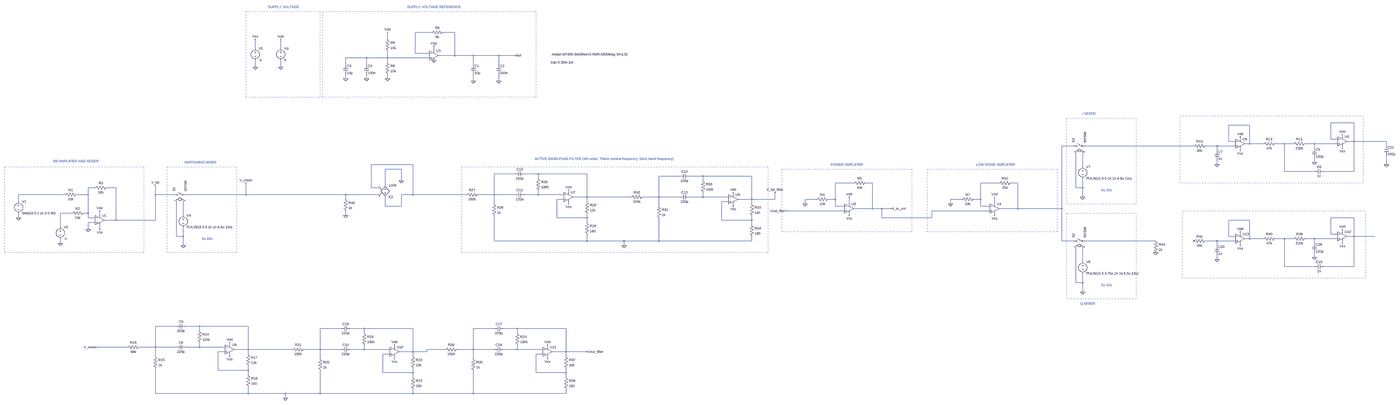
[diagram p0: schematic transceiver.asc, whole sheet]
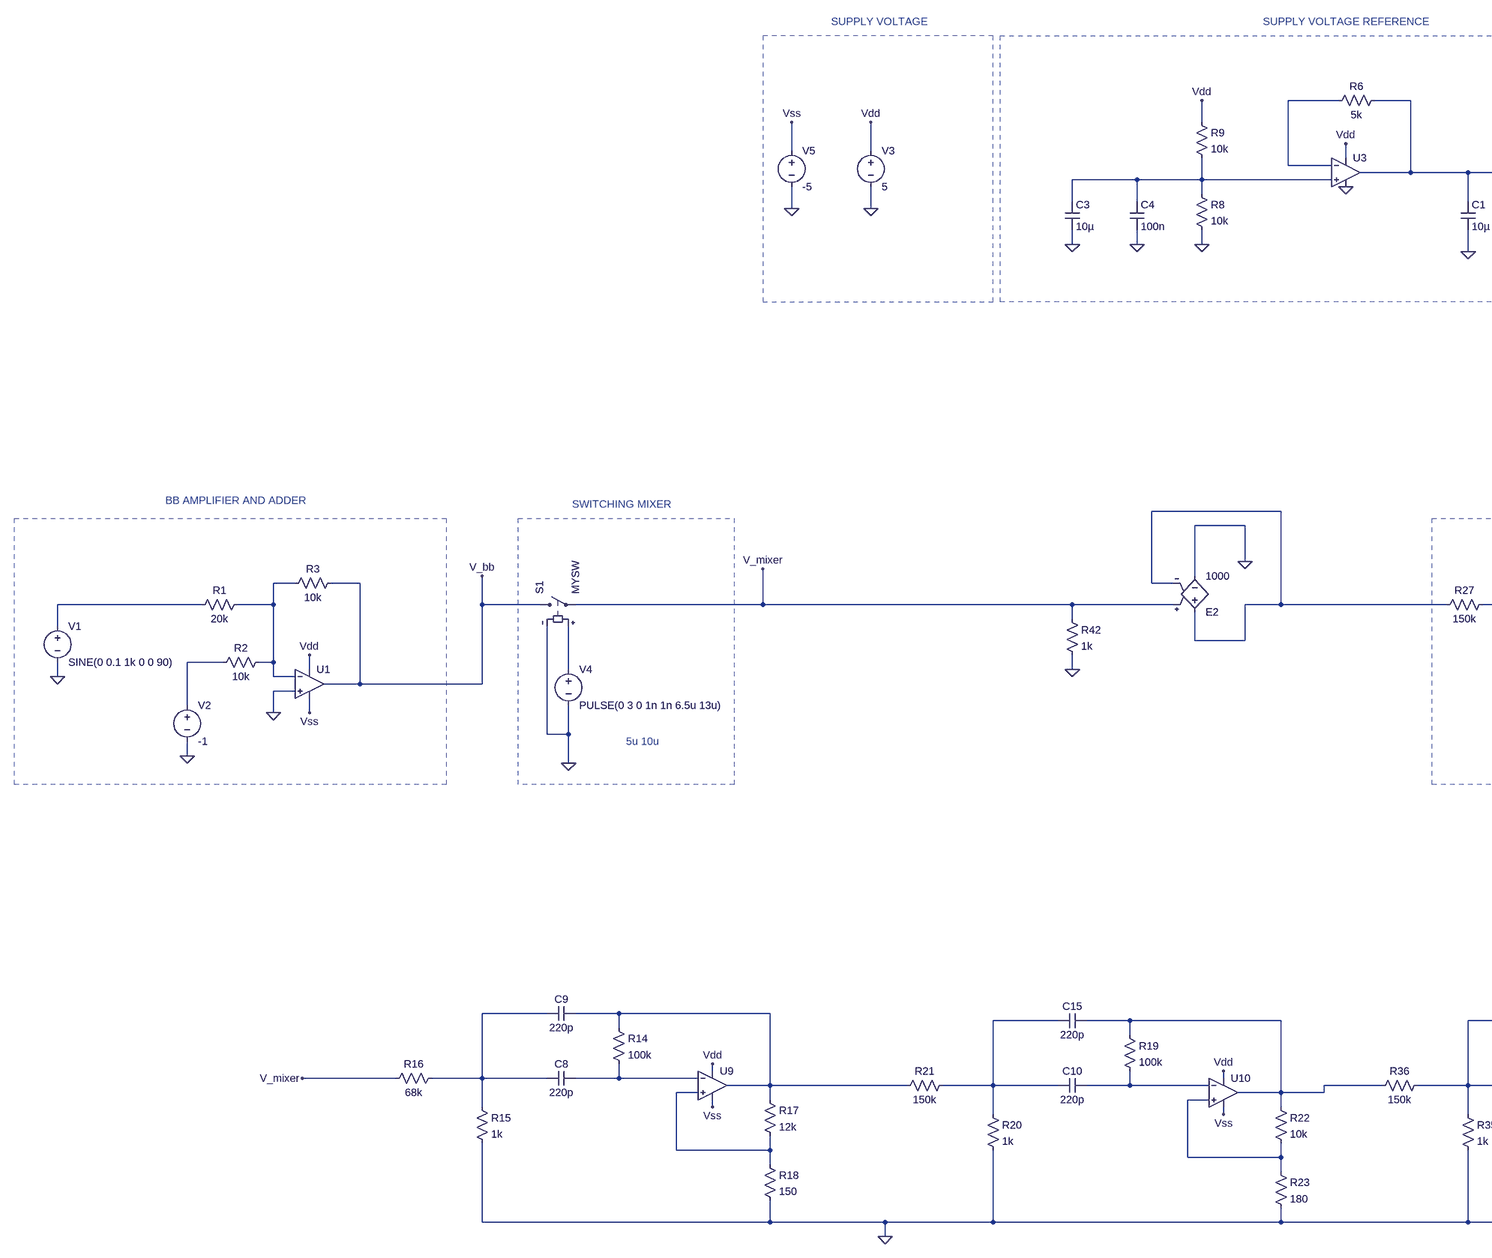
[diagram p1: schematic transceiver.asc, part, row 1 of 1, column 1 of 3]
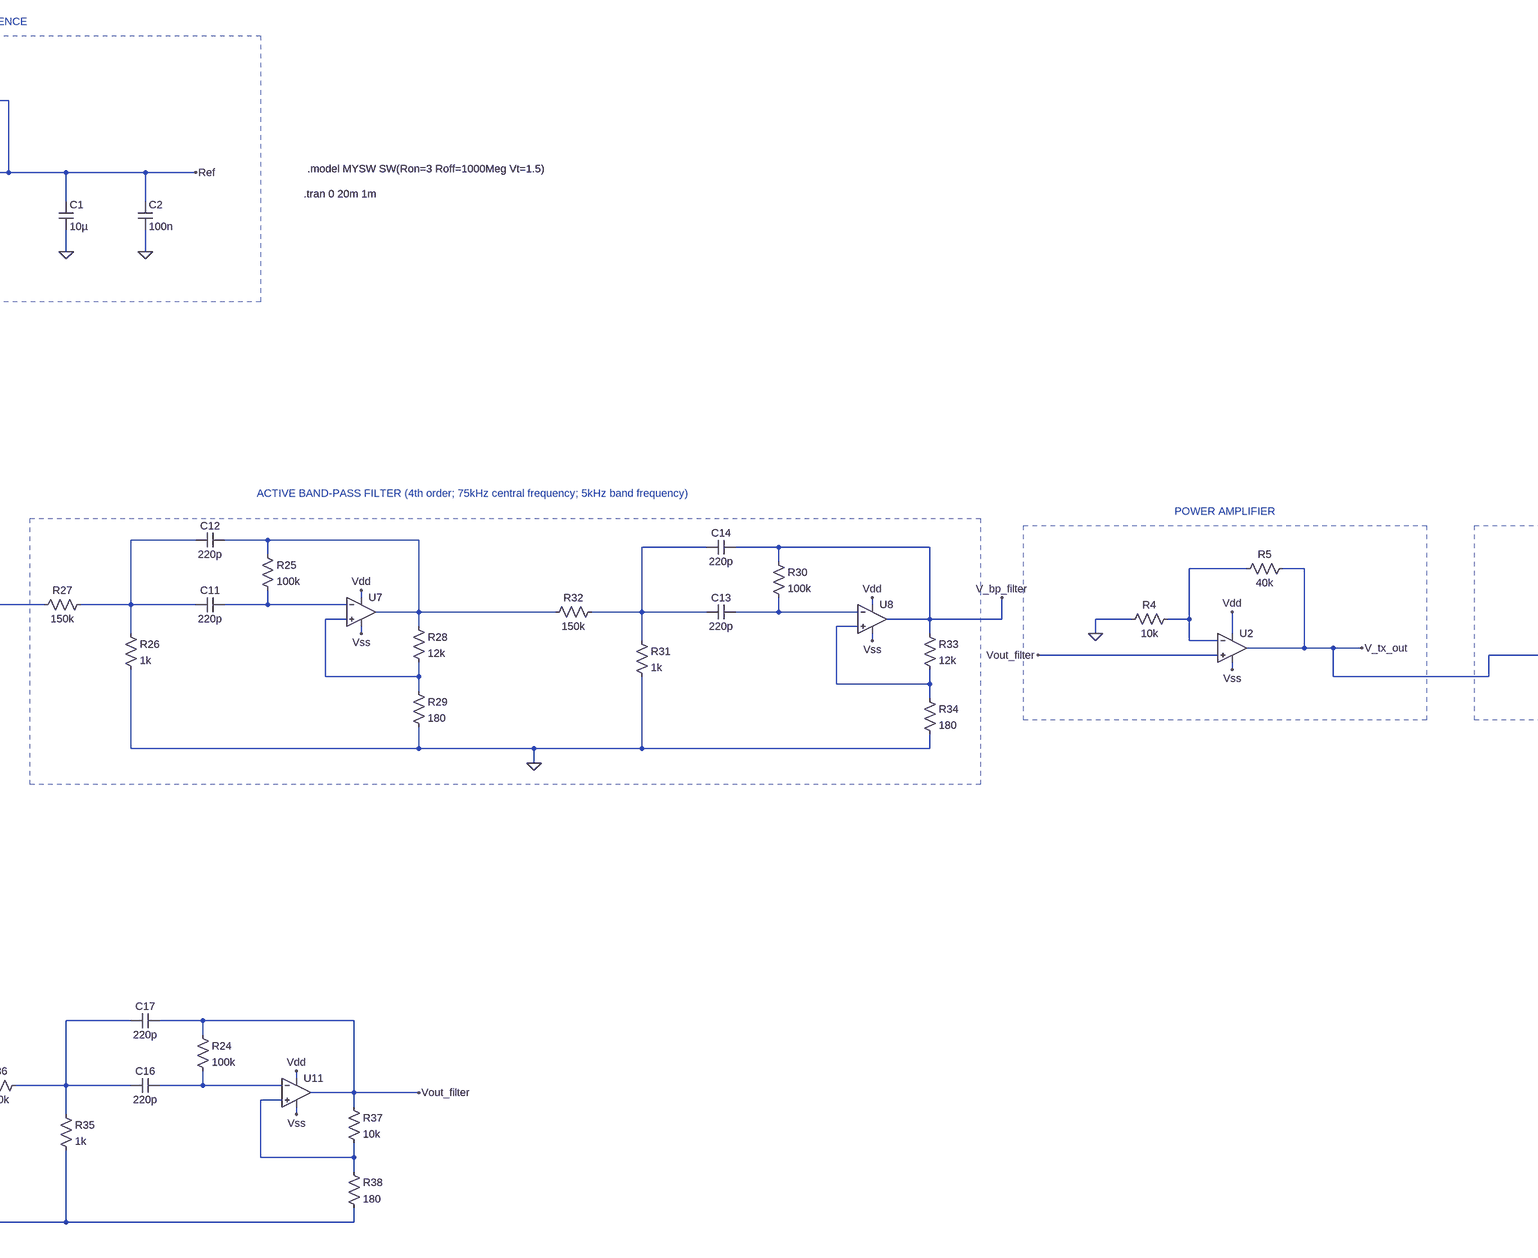
[diagram p2: schematic transceiver.asc, part, row 1 of 1, column 2 of 3]
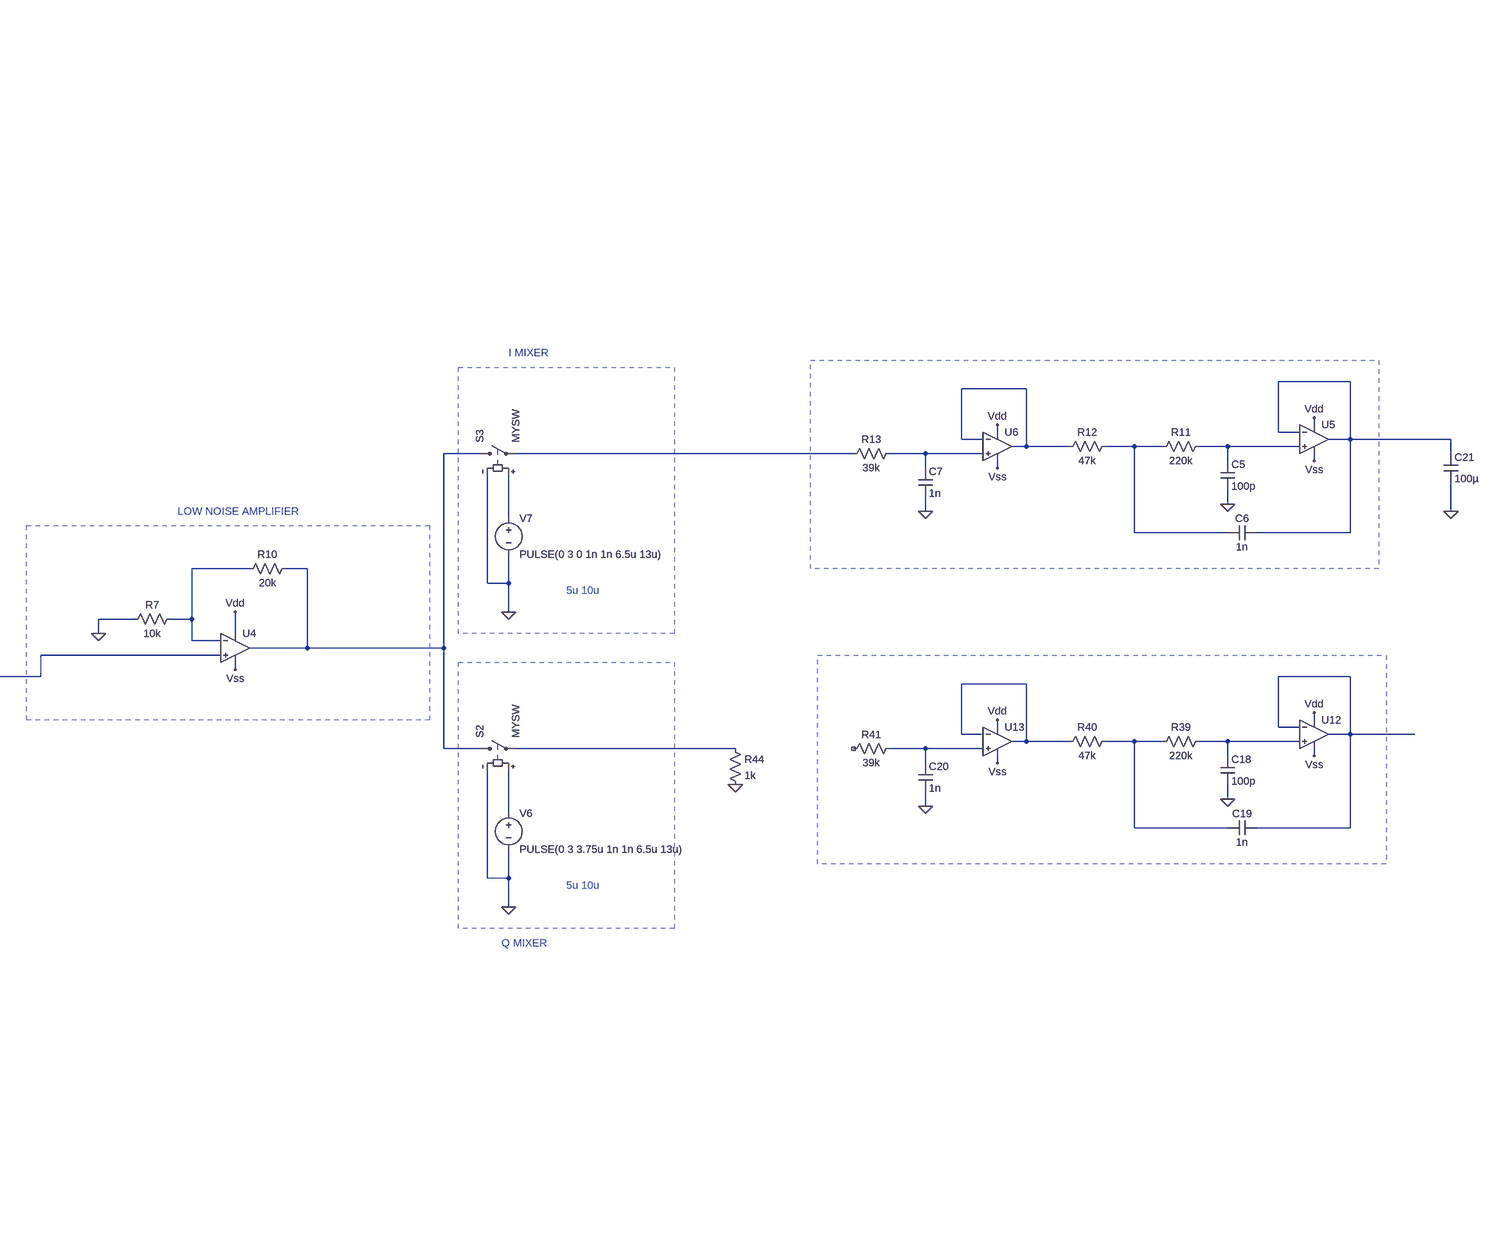
[diagram p3: schematic transceiver.asc, part, row 1 of 1, column 3 of 3]
transceiver.asc, the LTspice schematic file:
Version 4
SHEET 1 5896 1220
WIRE -944 -1920 -1056 -1920
WIRE -784 -1920 -864 -1920
WIRE -1248 -1872 -1248 -1920
WIRE -2160 -1808 -2160 -1872
WIRE -1984 -1808 -1984 -1872
WIRE -928 -1792 -928 -1824
WIRE -1056 -1776 -1056 -1920
WIRE -960 -1776 -1056 -1776
WIRE -784 -1760 -784 -1920
WIRE -784 -1760 -896 -1760
WIRE -656 -1760 -784 -1760
WIRE -480 -1760 -656 -1760
WIRE -368 -1760 -480 -1760
WIRE -1392 -1744 -1536 -1744
WIRE -1248 -1744 -1248 -1792
WIRE -1248 -1744 -1392 -1744
WIRE -960 -1744 -1248 -1744
WIRE -1248 -1712 -1248 -1744
WIRE -1536 -1696 -1536 -1744
WIRE -1392 -1696 -1392 -1744
WIRE -656 -1696 -656 -1760
WIRE -480 -1696 -480 -1760
WIRE -2160 -1680 -2160 -1728
WIRE -1984 -1680 -1984 -1728
WIRE -1536 -1600 -1536 -1632
WIRE -1392 -1600 -1392 -1632
WIRE -1248 -1600 -1248 -1632
WIRE -656 -1584 -656 -1632
WIRE -480 -1584 -480 -1632
WIRE 5600 -768 5440 -768
WIRE 4880 -752 4736 -752
WIRE 5520 -672 5520 -688
WIRE 4816 -656 4816 -672
WIRE 5440 -656 5440 -768
WIRE 5488 -656 5440 -656
WIRE 4736 -640 4736 -752
WIRE 4784 -640 4736 -640
WIRE 5600 -640 5600 -768
WIRE 5600 -640 5552 -640
WIRE 5824 -640 5600 -640
WIRE 4880 -624 4880 -752
WIRE 4880 -624 4848 -624
WIRE 4976 -624 4880 -624
WIRE 5120 -624 5056 -624
WIRE 5184 -624 5120 -624
WIRE 5328 -624 5264 -624
WIRE 5488 -624 5328 -624
WIRE 3584 -608 3504 -608
WIRE 4496 -608 3664 -608
WIRE 4656 -608 4576 -608
WIRE 4784 -608 4656 -608
WIRE 5824 -608 5824 -640
WIRE 5328 -592 5328 -624
WIRE 5520 -592 5520 -608
WIRE 4656 -576 4656 -608
WIRE 4816 -576 4816 -592
WIRE 5328 -496 5328 -528
WIRE -1072 -480 -1360 -480
WIRE 4656 -480 4656 -512
WIRE 5824 -480 5824 -544
WIRE 3648 -464 3648 -560
WIRE -1152 -448 -1264 -448
WIRE 5120 -432 5120 -624
WIRE 5328 -432 5120 -432
WIRE 5600 -432 5600 -640
WIRE 5600 -432 5392 -432
WIRE -368 -416 -512 -416
WIRE -208 -416 -304 -416
WIRE 128 -416 -208 -416
WIRE 768 -400 624 -400
WIRE 928 -400 832 -400
WIRE 1264 -400 928 -400
WIRE -208 -384 -208 -416
WIRE -1152 -368 -1152 -448
WIRE 928 -368 928 -400
WIRE 1968 -352 1840 -352
WIRE 2096 -352 2048 -352
WIRE 3072 -352 2944 -352
WIRE 3200 -352 3152 -352
WIRE -1264 -336 -1264 -448
WIRE -3264 -320 -3312 -320
WIRE -3120 -320 -3184 -320
WIRE -1360 -320 -1360 -480
WIRE -1312 -320 -1360 -320
WIRE 3600 -320 3600 -560
WIRE 3648 -320 3648 -384
WIRE 3648 -320 3600 -320
WIRE 0 -288 0 -304
WIRE -3472 -272 -3792 -272
WIRE -3312 -272 -3312 -320
WIRE -3312 -272 -3392 -272
WIRE -2848 -272 -2848 -336
WIRE -2720 -272 -2848 -272
WIRE -2224 -272 -2224 -352
WIRE -2224 -272 -2640 -272
WIRE -1536 -272 -2224 -272
WIRE -1312 -272 -1536 -272
WIRE -1072 -272 -1072 -480
WIRE -1072 -272 -1152 -272
WIRE -704 -272 -1072 -272
WIRE -512 -272 -512 -416
WIRE -512 -272 -624 -272
WIRE -368 -272 -512 -272
WIRE -208 -272 -208 -304
WIRE -208 -272 -304 -272
WIRE -32 -272 -208 -272
WIRE 1136 -272 1136 -288
WIRE 128 -256 128 -416
WIRE 128 -256 32 -256
WIRE 432 -256 128 -256
WIRE 624 -256 624 -400
WIRE 624 -256 512 -256
WIRE 768 -256 624 -256
WIRE 928 -256 928 -288
WIRE 928 -256 832 -256
WIRE 1104 -256 928 -256
WIRE 3648 -256 3648 -320
WIRE -1536 -240 -1536 -272
WIRE -32 -240 -80 -240
WIRE 1264 -240 1264 -400
WIRE 1264 -240 1168 -240
WIRE 1424 -240 1424 -288
WIRE 1424 -240 1264 -240
WIRE 1712 -240 1632 -240
WIRE 1840 -240 1840 -352
WIRE 1840 -240 1792 -240
WIRE 2816 -240 2736 -240
WIRE 2944 -240 2944 -352
WIRE 2944 -240 2896 -240
WIRE -3792 -224 -3792 -272
WIRE 128 -224 128 -256
WIRE 1104 -224 1056 -224
WIRE -512 -208 -512 -272
WIRE 0 -208 0 -224
WIRE 1264 -208 1264 -240
WIRE 1632 -208 1632 -240
WIRE 1936 -208 1936 -256
WIRE 2736 -208 2736 -240
WIRE 3040 -208 3040 -256
WIRE -1264 -192 -1264 -256
WIRE -1152 -192 -1152 -272
WIRE -1152 -192 -1264 -192
WIRE 624 -192 624 -256
WIRE 1136 -192 1136 -208
WIRE 1840 -192 1840 -240
WIRE 1904 -192 1840 -192
WIRE 2944 -192 2944 -240
WIRE 3008 -192 2944 -192
WIRE 2096 -176 2096 -352
WIRE 2096 -176 1968 -176
WIRE 2160 -176 2096 -176
WIRE 2224 -176 2160 -176
WIRE 3200 -176 3200 -352
WIRE 3200 -176 3072 -176
WIRE 3504 -176 3504 -608
WIRE 3504 -176 3200 -176
WIRE 1904 -160 1504 -160
WIRE 3008 -160 2608 -160
WIRE -3424 -144 -3504 -144
WIRE -3312 -144 -3312 -272
WIRE -3312 -144 -3344 -144
WIRE -3232 -128 -3232 -160
WIRE -2656 -128 -2656 -224
WIRE -1536 -128 -1536 -160
WIRE 1936 -128 1936 -144
WIRE 3040 -128 3040 -144
WIRE -3792 -112 -3792 -144
WIRE -3312 -112 -3312 -144
WIRE -3264 -112 -3312 -112
WIRE -80 -112 -80 -240
WIRE 128 -112 128 -144
WIRE 128 -112 -80 -112
WIRE 2160 -112 2160 -176
WIRE 2608 -112 2608 -160
WIRE 2608 -112 2160 -112
WIRE 5600 -112 5440 -112
WIRE -3120 -96 -3120 -320
WIRE -3120 -96 -3200 -96
WIRE -2848 -96 -2848 -272
WIRE -2848 -96 -3120 -96
WIRE 1056 -96 1056 -224
WIRE 1264 -96 1264 -128
WIRE 1264 -96 1056 -96
WIRE 4880 -96 4736 -96
WIRE -3264 -80 -3312 -80
WIRE 128 -80 128 -112
WIRE 1264 -64 1264 -96
WIRE -3504 -48 -3504 -144
WIRE -3312 -32 -3312 -80
WIRE -3232 -32 -3232 -64
WIRE 5520 -16 5520 -32
WIRE 4816 0 4816 -16
WIRE 5440 0 5440 -112
WIRE 5488 0 5440 0
WIRE -2704 16 -2704 -224
WIRE -2656 16 -2656 -48
WIRE -2656 16 -2704 16
WIRE 4736 16 4736 -96
WIRE 4784 16 4736 16
WIRE 5600 16 5600 -112
WIRE 5600 16 5552 16
WIRE 5744 16 5600 16
WIRE 4880 32 4880 -96
WIRE 4880 32 4848 32
WIRE 4976 32 4880 32
WIRE 5120 32 5056 32
WIRE 5184 32 5120 32
WIRE 5328 32 5264 32
WIRE 5488 32 5328 32
WIRE -512 48 -512 -128
WIRE 128 48 128 0
WIRE 128 48 -512 48
WIRE 384 48 128 48
WIRE 624 48 624 -112
WIRE 624 48 384 48
WIRE 1264 48 1264 16
WIRE 1264 48 624 48
WIRE 3504 48 3504 -176
WIRE 3584 48 3504 48
WIRE 4160 48 3664 48
WIRE 4656 48 4576 48
WIRE 4784 48 4656 48
WIRE -3504 64 -3504 32
WIRE 5328 64 5328 32
WIRE 5520 64 5520 48
WIRE -2656 80 -2656 16
WIRE 384 80 384 48
WIRE 4656 80 4656 48
WIRE 4816 80 4816 64
WIRE 5328 160 5328 128
WIRE 4656 176 4656 144
WIRE 3648 192 3648 96
WIRE 5120 224 5120 32
WIRE 5328 224 5120 224
WIRE 5600 224 5600 16
WIRE 5600 224 5392 224
WIRE 3600 336 3600 96
WIRE 3648 336 3648 272
WIRE 3648 336 3600 336
WIRE 3648 400 3648 336
WIRE -2704 672 -2848 672
WIRE -2544 672 -2640 672
WIRE -2208 672 -2544 672
WIRE -1568 688 -1712 688
WIRE -1408 688 -1504 688
WIRE -1072 688 -1408 688
WIRE -512 688 -656 688
WIRE -352 688 -448 688
WIRE -16 688 -352 688
WIRE -2544 704 -2544 672
WIRE -1408 720 -1408 688
WIRE -352 720 -352 688
WIRE -2336 800 -2336 784
WIRE -3040 816 -3248 816
WIRE -2848 816 -2848 672
WIRE -2848 816 -2960 816
WIRE -2704 816 -2848 816
WIRE -2544 816 -2544 784
WIRE -2544 816 -2640 816
WIRE -2368 816 -2544 816
WIRE -1200 816 -1200 800
WIRE -144 816 -144 800
WIRE -2208 832 -2208 672
WIRE -2208 832 -2304 832
WIRE -1904 832 -2208 832
WIRE -1712 832 -1712 688
WIRE -1712 832 -1824 832
WIRE -1568 832 -1712 832
WIRE -1408 832 -1408 800
WIRE -1408 832 -1504 832
WIRE -1232 832 -1408 832
WIRE -848 832 -976 832
WIRE -656 832 -656 688
WIRE -656 832 -768 832
WIRE -512 832 -656 832
WIRE -352 832 -352 800
WIRE -352 832 -448 832
WIRE -176 832 -352 832
WIRE -2368 848 -2416 848
WIRE -1072 848 -1072 688
WIRE -1072 848 -1168 848
WIRE -976 848 -976 832
WIRE -976 848 -1072 848
WIRE -16 848 -16 688
WIRE -16 848 -112 848
WIRE 128 848 -16 848
WIRE -2208 864 -2208 832
WIRE -1232 864 -1280 864
WIRE -176 864 -224 864
WIRE -2848 880 -2848 816
WIRE -2336 880 -2336 864
WIRE -1072 880 -1072 848
WIRE -16 880 -16 848
WIRE -1712 896 -1712 832
WIRE -1200 896 -1200 880
WIRE -656 896 -656 832
WIRE -144 896 -144 880
WIRE -2416 976 -2416 848
WIRE -2208 976 -2208 944
WIRE -2208 976 -2416 976
WIRE -1280 992 -1280 864
WIRE -1072 992 -1072 960
WIRE -1072 992 -1280 992
WIRE -224 992 -224 864
WIRE -16 992 -16 960
WIRE -16 992 -224 992
WIRE -2208 1008 -2208 976
WIRE -1072 1024 -1072 992
WIRE -16 1024 -16 992
WIRE -2848 1136 -2848 960
WIRE -2208 1136 -2208 1088
WIRE -2208 1136 -2848 1136
WIRE -1952 1136 -2208 1136
WIRE -1712 1136 -1712 976
WIRE -1712 1136 -1952 1136
WIRE -1072 1136 -1072 1104
WIRE -1072 1136 -1712 1136
WIRE -656 1136 -656 976
WIRE -656 1136 -1072 1136
WIRE -16 1136 -16 1104
WIRE -16 1136 -656 1136
WIRE -1952 1168 -1952 1136
FLAG -3792 -112 0
FLAG -3504 64 0
FLAG -3312 -32 0
FLAG -3232 -160 Vdd
FLAG -1984 -1872 Vdd
FLAG -1984 -1680 0
FLAG 1632 -208 0
FLAG 1936 -256 Vdd
FLAG -2656 80 0
FLAG 2224 -176 V_tx_out
FLAG -656 -1584 0
FLAG -480 -1584 0
FLAG -928 -1728 0
FLAG -1536 -1600 0
FLAG -1392 -1600 0
FLAG -1248 -1600 0
FLAG -1248 -1920 Vdd
FLAG -368 -1760 Ref
FLAG -928 -1824 Vdd
FLAG 0 -304 Vdd
FLAG 1136 -288 Vdd
FLAG -2848 -336 V_bb
FLAG -2224 -352 V_mixer
FLAG -2160 -1680 0
FLAG -2160 -1872 Vss
FLAG -3232 -32 Vss
FLAG 0 -208 Vss
FLAG 1136 -192 Vss
FLAG 1936 -128 Vss
FLAG 384 80 0
FLAG 1424 -288 V_bp_filter
FLAG 2736 -208 0
FLAG 3040 -256 Vdd
FLAG 3040 -128 Vss
FLAG 3648 400 0
FLAG 3648 -256 0
FLAG 5520 -688 Vdd
FLAG 5520 -592 Vss
FLAG 5328 -496 0
FLAG 4816 -672 Vdd
FLAG 4816 -576 Vss
FLAG 4656 -480 0
FLAG -2336 784 Vdd
FLAG -1200 800 Vdd
FLAG -2336 880 Vss
FLAG -1200 896 Vss
FLAG -1952 1168 0
FLAG -144 800 Vdd
FLAG -144 896 Vss
FLAG -3248 816 V_mixer
FLAG 128 848 Vout_filter
FLAG 5520 -32 Vdd
FLAG 5520 64 Vss
FLAG 5328 160 0
FLAG 4816 -16 Vdd
FLAG 4816 80 Vss
FLAG 4656 176 0
FLAG 4160 128 0
FLAG 1504 -160 Vout_filter
FLAG 5824 -480 0
FLAG -1152 -368 0
FLAG -1536 -128 0
SYMBOL voltage -3792 -240 R0
WINDOW 123 0 0 Left 0
WINDOW 39 0 0 Left 0
SYMATTR InstName V1
SYMATTR Value SINE(0 0.1 1k 0 0 90)
SYMBOL res -3376 -288 R90
WINDOW 0 0 56 VBottom 2
WINDOW 3 32 56 VTop 2
SYMATTR InstName R1
SYMATTR Value 20k
SYMBOL res -3328 -160 R90
WINDOW 0 0 56 VBottom 2
WINDOW 3 32 56 VTop 2
SYMATTR InstName R2
SYMATTR Value 10k
SYMBOL res -3168 -336 R90
WINDOW 0 0 56 VBottom 2
WINDOW 3 32 56 VTop 2
SYMATTR InstName R3
SYMATTR Value 10k
SYMBOL OpAmps\\UniversalOpAmp2 -3232 -96 R0
SYMATTR InstName U1
SYMBOL OpAmps\\UniversalOpAmp2 1936 -176 R0
SYMATTR InstName U2
SYMBOL voltage -1984 -1824 R0
WINDOW 123 0 0 Left 0
WINDOW 39 0 0 Left 0
SYMATTR InstName V3
SYMATTR Value 5
SYMBOL res 1808 -256 R90
WINDOW 0 0 56 VBottom 2
WINDOW 3 32 56 VTop 2
SYMATTR InstName R4
SYMATTR Value 10k
SYMBOL res 2064 -368 R90
WINDOW 0 0 56 VBottom 2
WINDOW 3 32 56 VTop 2
SYMATTR InstName R5
SYMATTR Value 40k
SYMBOL sw -2736 -272 R270
SYMATTR InstName S1
SYMATTR Value MYSW
SYMBOL voltage -2656 -144 R0
WINDOW 123 0 0 Left 0
WINDOW 39 0 0 Left 0
SYMATTR InstName V4
SYMATTR Value PULSE(0 3 0 1n 1n 6.5u 13u)
SYMBOL OpAmps\\UniversalOpAmp2 -928 -1760 R0
SYMATTR InstName U3
SYMBOL res -848 -1936 R90
WINDOW 0 0 56 VBottom 2
WINDOW 3 32 56 VTop 2
SYMATTR InstName R6
SYMATTR Value 5k
SYMBOL cap -672 -1696 R0
SYMATTR InstName C1
SYMATTR Value 10µ
SYMBOL cap -496 -1696 R0
SYMATTR InstName C2
SYMATTR Value 100n
SYMBOL res -1264 -1728 R0
SYMATTR InstName R8
SYMATTR Value 10k
SYMBOL res -1264 -1888 R0
SYMATTR InstName R9
SYMATTR Value 10k
SYMBOL cap -1552 -1696 R0
SYMATTR InstName C3
SYMATTR Value 10µ
SYMBOL cap -1408 -1696 R0
SYMATTR InstName C4
SYMATTR Value 100n
SYMBOL OpAmps\\UniversalOpAmp2 0 -256 R0
SYMATTR InstName U7
SYMBOL cap -304 -288 R90
WINDOW 0 0 32 VBottom 2
WINDOW 3 32 32 VTop 2
SYMATTR InstName C11
SYMATTR Value 220p
SYMBOL cap -304 -432 R90
WINDOW 0 0 32 VBottom 2
WINDOW 3 32 32 VTop 2
SYMATTR InstName C12
SYMATTR Value 220p
SYMBOL res -224 -400 R0
SYMATTR InstName R25
SYMATTR Value 100k
SYMBOL res -528 -224 R0
SYMATTR InstName R26
SYMATTR Value 1k
SYMBOL res -608 -288 R90
WINDOW 0 0 56 VBottom 2
WINDOW 3 32 56 VTop 2
SYMATTR InstName R27
SYMATTR Value 150k
SYMBOL res 112 -240 R0
SYMATTR InstName R28
SYMATTR Value 12k
SYMBOL res 112 -96 R0
SYMATTR InstName R29
SYMATTR Value 180
SYMBOL OpAmps\\UniversalOpAmp2 1136 -240 R0
SYMATTR InstName U8
SYMBOL cap 832 -272 R90
WINDOW 0 0 32 VBottom 2
WINDOW 3 32 32 VTop 2
SYMATTR InstName C13
SYMATTR Value 220p
SYMBOL cap 832 -416 R90
WINDOW 0 0 32 VBottom 2
WINDOW 3 32 32 VTop 2
SYMATTR InstName C14
SYMATTR Value 220p
SYMBOL res 912 -384 R0
SYMATTR InstName R30
SYMATTR Value 100k
SYMBOL res 608 -208 R0
SYMATTR InstName R31
SYMATTR Value 1k
SYMBOL res 528 -272 R90
WINDOW 0 0 56 VBottom 2
WINDOW 3 32 56 VTop 2
SYMATTR InstName R32
SYMATTR Value 150k
SYMBOL res 1248 -224 R0
SYMATTR InstName R33
SYMATTR Value 12k
SYMBOL res 1248 -80 R0
SYMATTR InstName R34
SYMATTR Value 180
SYMBOL voltage -2160 -1824 R0
WINDOW 123 0 0 Left 0
WINDOW 39 0 0 Left 0
SYMATTR InstName V5
SYMATTR Value -5
SYMBOL voltage -3504 -64 R0
WINDOW 123 0 0 Left 0
WINDOW 39 0 0 Left 0
SYMATTR InstName V2
SYMATTR Value -1
SYMBOL OpAmps\\UniversalOpAmp2 3040 -176 R0
SYMATTR InstName U4
SYMBOL res 2912 -256 R90
WINDOW 0 0 56 VBottom 2
WINDOW 3 32 56 VTop 2
SYMATTR InstName R7
SYMATTR Value 10k
SYMBOL res 3168 -368 R90
WINDOW 0 0 56 VBottom 2
WINDOW 3 32 56 VTop 2
SYMATTR InstName R10
SYMATTR Value 20k
SYMBOL sw 3568 48 R270
SYMATTR InstName S2
SYMATTR Value MYSW
SYMBOL voltage 3648 176 R0
WINDOW 123 0 0 Left 0
WINDOW 39 0 0 Left 0
SYMATTR InstName V6
SYMATTR Value PULSE(0 3 3.75u 1n 1n 6.5u 13u)
SYMBOL sw 3568 -608 R270
SYMATTR InstName S3
SYMATTR Value MYSW
SYMBOL voltage 3648 -480 R0
WINDOW 123 0 0 Left 0
WINDOW 39 0 0 Left 0
SYMATTR InstName V7
SYMATTR Value PULSE(0 3 0 1n 1n 6.5u 13u)
SYMBOL OpAmps\\UniversalOpAmp2 5520 -640 R0
SYMATTR InstName U5
SYMBOL cap 5312 -592 R0
SYMATTR InstName C5
SYMATTR Value 100p
SYMBOL cap 5392 -448 R90
WINDOW 0 0 32 VBottom 2
WINDOW 3 32 32 VTop 2
SYMATTR InstName C6
SYMATTR Value 1n
SYMBOL res 5280 -640 R90
WINDOW 0 0 56 VBottom 2
WINDOW 3 32 56 VTop 2
SYMATTR InstName R11
SYMATTR Value 220k
SYMBOL res 5072 -640 R90
WINDOW 0 0 56 VBottom 2
WINDOW 3 32 56 VTop 2
SYMATTR InstName R12
SYMATTR Value 47k
SYMBOL OpAmps\\UniversalOpAmp2 4816 -624 R0
SYMATTR InstName U6
SYMBOL cap 4640 -576 R0
SYMATTR InstName C7
SYMATTR Value 1n
SYMBOL res 4592 -624 R90
WINDOW 0 0 56 VBottom 2
WINDOW 3 32 56 VTop 2
SYMATTR InstName R13
SYMATTR Value 39k
SYMBOL OpAmps\\UniversalOpAmp2 -2336 832 R0
SYMATTR InstName U9
SYMBOL cap -2640 800 R90
WINDOW 0 0 32 VBottom 2
WINDOW 3 32 32 VTop 2
SYMATTR InstName C8
SYMATTR Value 220p
SYMBOL cap -2640 656 R90
WINDOW 0 0 32 VBottom 2
WINDOW 3 32 32 VTop 2
SYMATTR InstName C9
SYMATTR Value 220p
SYMBOL res -2560 688 R0
SYMATTR InstName R14
SYMATTR Value 100k
SYMBOL res -2864 864 R0
SYMATTR InstName R15
SYMATTR Value 1k
SYMBOL res -2944 800 R90
WINDOW 0 0 56 VBottom 2
WINDOW 3 32 56 VTop 2
SYMATTR InstName R16
SYMATTR Value 68k
SYMBOL res -2224 848 R0
SYMATTR InstName R17
SYMATTR Value 12k
SYMBOL res -2224 992 R0
SYMATTR InstName R18
SYMATTR Value 150
SYMBOL OpAmps\\UniversalOpAmp2 -1200 848 R0
SYMATTR InstName U10
SYMBOL cap -1504 816 R90
WINDOW 0 0 32 VBottom 2
WINDOW 3 32 32 VTop 2
SYMATTR InstName C10
SYMATTR Value 220p
SYMBOL cap -1504 672 R90
WINDOW 0 0 32 VBottom 2
WINDOW 3 32 32 VTop 2
SYMATTR InstName C15
SYMATTR Value 220p
SYMBOL res -1424 704 R0
SYMATTR InstName R19
SYMATTR Value 100k
SYMBOL res -1728 880 R0
SYMATTR InstName R20
SYMATTR Value 1k
SYMBOL res -1808 816 R90
WINDOW 0 0 56 VBottom 2
WINDOW 3 32 56 VTop 2
SYMATTR InstName R21
SYMATTR Value 150k
SYMBOL res -1088 864 R0
SYMATTR InstName R22
SYMATTR Value 10k
SYMBOL res -1088 1008 R0
SYMATTR InstName R23
SYMATTR Value 180
SYMBOL OpAmps\\UniversalOpAmp2 -144 848 R0
SYMATTR InstName U11
SYMBOL cap -448 816 R90
WINDOW 0 0 32 VBottom 2
WINDOW 3 32 32 VTop 2
SYMATTR InstName C16
SYMATTR Value 220p
SYMBOL cap -448 672 R90
WINDOW 0 0 32 VBottom 2
WINDOW 3 32 32 VTop 2
SYMATTR InstName C17
SYMATTR Value 220p
SYMBOL res -368 704 R0
SYMATTR InstName R24
SYMATTR Value 100k
SYMBOL res -672 880 R0
SYMATTR InstName R35
SYMATTR Value 1k
SYMBOL res -752 816 R90
WINDOW 0 0 56 VBottom 2
WINDOW 3 32 56 VTop 2
SYMATTR InstName R36
SYMATTR Value 150k
SYMBOL res -32 864 R0
SYMATTR InstName R37
SYMATTR Value 10k
SYMBOL res -32 1008 R0
SYMATTR InstName R38
SYMATTR Value 180
SYMBOL OpAmps\\UniversalOpAmp2 5520 16 R0
SYMATTR InstName U12
SYMBOL cap 5312 64 R0
SYMATTR InstName C18
SYMATTR Value 100p
SYMBOL cap 5392 208 R90
WINDOW 0 0 32 VBottom 2
WINDOW 3 32 32 VTop 2
SYMATTR InstName C19
SYMATTR Value 1n
SYMBOL res 5280 16 R90
WINDOW 0 0 56 VBottom 2
WINDOW 3 32 56 VTop 2
SYMATTR InstName R39
SYMATTR Value 220k
SYMBOL res 5072 16 R90
WINDOW 0 0 56 VBottom 2
WINDOW 3 32 56 VTop 2
SYMATTR InstName R40
SYMATTR Value 47k
SYMBOL OpAmps\\UniversalOpAmp2 4816 32 R0
SYMATTR InstName U13
SYMBOL cap 4640 80 R0
SYMATTR InstName C20
SYMATTR Value 1n
SYMBOL res 4592 32 R90
WINDOW 0 0 56 VBottom 2
WINDOW 3 32 56 VTop 2
SYMATTR InstName R41
SYMATTR Value 39k
SYMBOL res 4144 32 R0
SYMATTR InstName R44
SYMATTR Value 1k
SYMBOL cap 5808 -608 R0
SYMATTR InstName C21
SYMATTR Value 100µ
SYMBOL e -1264 -240 M180
SYMATTR InstName E2
SYMATTR Value 1000
SYMBOL res -1552 -256 R0
SYMATTR InstName R42
SYMATTR Value 1k
TEXT -128 -1712 Left 2 !.tran 0 20m 1m
TEXT -120 -1768 Left 2 !.model MYSW SW(Ron=3 Roff=1000Meg Vt=1.5)
TEXT -1112 -2096 Left 2 ;SUPPLY VOLTAGE REFERENCE
TEXT -232 -520 Left 2 ;ACTIVE BAND-PASS FILTER (4th order; 75kHz central frequency; 5kHz band frequency)
TEXT -2072 -2096 Left 2 ;SUPPLY VOLTAGE
TEXT -2648 -496 Left 2 ;SWITCHING MIXER
TEXT -3552 -504 Left 2 ;BB AMPLIFIER AND ADDER
TEXT 1808 -480 Left 2 ;POWER AMPLIFIER
TEXT -2528 32 Left 2 ;5u 10u
TEXT 2912 -480 Left 2 ;LOW NOISE AMPLIFIER
TEXT 3776 352 Left 2 ;5u 10u
TEXT 3776 -304 Left 2 ;5u 10u
TEXT 3648 -832 Left 2 ;I MIXER
TEXT 3632 480 Left 2 ;Q MIXER
RECTANGLE Normal -224 -1472 -1696 -2064 2
RECTANGLE Normal -2224 -1472 -1712 -2064 2
RECTANGLE Normal -2928 128 -3888 -464 2
RECTANGLE Normal -2288 128 -2768 -464 2
RECTANGLE Normal 1376 128 -736 -464 2
RECTANGLE Normal 2368 -16 1472 -448 2
RECTANGLE Normal 3472 -16 2576 -448 2
RECTANGLE Normal 4016 448 3536 -144 2
RECTANGLE Normal 4016 -208 3536 -800 2
RECTANGLE Normal 5664 -352 4400 -816 2
RECTANGLE Normal 5680 304 4416 -160 2

The netlist it stands for:
* transceiver.asc
V1 N018 0 SINE(0 0.1 1k 0 0 90)
R1 N017 N018 20k
R2 N017 N023 10k
R3 V_bb N017 10k
XU1 0 N017 Vdd Vss V_bb level2 Avol=1Meg GBW=10Meg Slew=10Meg Ilimit=25m Rail=0 Vos=0 En=0 Enk=0 In=0 Ink=0 Rin=500Meg  ; pins In+ In- V+ V- OUT
XU2 Vout_filter N015 Vdd Vss V_tx_out level2 Avol=1Meg GBW=10Meg Slew=10Meg Ilimit=25m Rail=0 Vos=0 En=0 Enk=0 In=0 Ink=0 Rin=500Meg  ; pins In+ In- V+ V- OUT
V3 Vdd 0 5
R4 N015 0 10k
R5 V_tx_out N015 40k
S1 V_bb V_mixer N024 0 MYSW
V4 N024 0 PULSE(0 3 0 1n 1n 6.5u 13u)
XU3 N002 N001 Vdd 0 Ref level2 Avol=1Meg GBW=10Meg Slew=10Meg Ilimit=25m Rail=0 Vos=0 En=0 Enk=0 In=0 Ink=0 Rin=500Meg  ; pins In+ In- V+ V- OUT
R6 Ref N001 5k
C1 Ref 0 10µ
C2 Ref 0 100n
R8 N002 0 10k
R9 Vdd N002 10k
C3 N002 0 10µ
C4 N002 0 100n
XU7 N021 N019 Vdd Vss N013 level2 Avol=1Meg GBW=10Meg Slew=10Meg Ilimit=25m Rail=0 Vos=0 En=0 Enk=0 In=0 Ink=0 Rin=500Meg  ; pins In+ In- V+ V- OUT
C11 N019 N012 220p
C12 N013 N012 220p
R25 N013 N019 100k
R26 N012 0 1k
R27 N012 N010 150k
R28 N013 N021 12k
R29 N021 0 180
XU8 N022 N020 Vdd Vss V_bp_filter level2 Avol=1Meg GBW=10Meg Slew=10Meg Ilimit=25m Rail=0 Vos=0 En=0 Enk=0 In=0 Ink=0 Rin=500Meg  ; pins In+ In- V+ V- OUT
C13 N020 N014 220p
C14 V_bp_filter N014 220p
R30 V_bp_filter N020 100k
R31 N014 0 1k
R32 N014 N013 150k
R33 V_bp_filter N022 12k
R34 N022 0 180
V5 Vss 0 -5
V2 N023 0 -1
XU4 V_tx_out N016 Vdd Vss N007 level2 Avol=1Meg GBW=10Meg Slew=10Meg Ilimit=25m Rail=0 Vos=0 En=0 Enk=0 In=0 Ink=0 Rin=500Meg  ; pins In+ In- V+ V- OUT
R7 N016 0 10k
R10 N007 N016 20k
S2 N007 N029 N031 0 MYSW
V6 N031 0 PULSE(0 3 3.75u 1n 1n 6.5u 13u)
S3 N007 N008 N011 0 MYSW
V7 N011 0 PULSE(0 3 0 1n 1n 6.5u 13u)
XU5 N006 N003 Vdd Vss N003 level2 Avol=1Meg GBW=10Meg Slew=10Meg Ilimit=25m Rail=0 Vos=0 En=0 Enk=0 In=0 Ink=0 Rin=500Meg  ; pins In+ In- V+ V- OUT
C5 N006 0 100p
C6 N003 N005 1n
R11 N006 N005 220k
R12 N005 N004 47k
XU6 N009 N004 Vdd Vss N004 level2 Avol=1Meg GBW=10Meg Slew=10Meg Ilimit=25m Rail=0 Vos=0 En=0 Enk=0 In=0 Ink=0 Rin=500Meg  ; pins In+ In- V+ V- OUT
C7 N009 0 1n
R13 N009 N008 39k
XU9 N040 N037 Vdd Vss N033 level2 Avol=1Meg GBW=10Meg Slew=10Meg Ilimit=25m Rail=0 Vos=0 En=0 Enk=0 In=0 Ink=0 Rin=500Meg  ; pins In+ In- V+ V- OUT
C8 N037 N032 220p
C9 N033 N032 220p
R14 N033 N037 100k
R15 N032 0 1k
R16 N032 V_mixer 68k
R17 N033 N040 12k
R18 N040 0 150
XU10 N041 N038 Vdd Vss N035 level2 Avol=1Meg GBW=10Meg Slew=10Meg Ilimit=25m Rail=0 Vos=0 En=0 Enk=0 In=0 Ink=0 Rin=500Meg  ; pins In+ In- V+ V- OUT
C10 N038 N034 220p
C15 N035 N034 220p
R19 N035 N038 100k
R20 N034 0 1k
R21 N034 N033 150k
R22 N035 N041 10k
R23 N041 0 180
XU11 N042 N039 Vdd Vss Vout_filter level2 Avol=1Meg GBW=10Meg Slew=10Meg Ilimit=25m Rail=0 Vos=0 En=0 Enk=0 In=0 Ink=0 Rin=500Meg  ; pins In+ In- V+ V- OUT
C16 N039 N036 220p
C17 Vout_filter N036 220p
R24 Vout_filter N039 100k
R35 N036 0 1k
R36 N036 N035 150k
R37 Vout_filter N042 10k
R38 N042 0 180
XU12 N028 N025 Vdd Vss N025 level2 Avol=1Meg GBW=10Meg Slew=10Meg Ilimit=25m Rail=0 Vos=0 En=0 Enk=0 In=0 Ink=0 Rin=500Meg  ; pins In+ In- V+ V- OUT
C18 N028 0 100p
C19 N025 N027 1n
R39 N028 N027 220k
R40 N027 N026 47k
XU13 N030 N026 Vdd Vss N026 level2 Avol=1Meg GBW=10Meg Slew=10Meg Ilimit=25m Rail=0 Vos=0 En=0 Enk=0 In=0 Ink=0 Rin=500Meg  ; pins In+ In- V+ V- OUT
C20 N030 0 1n
R41 N030 NC_01 39k
R44 N029 0 1k
C21 N003 0 100µ
E2 N010 0 V_mixer N010 1000
R42 V_mixer 0 1k
.tran 0 20m 1m
.model MYSW SW(Ron=3 Roff=1000Meg Vt=1.5)
* SUPPLY VOLTAGE REFERENCE
* ACTIVE BAND-PASS FILTER (4th order; 75kHz central frequency; 5kHz band frequency)
* SUPPLY VOLTAGE
* SWITCHING MIXER
* BB AMPLIFIER AND ADDER
* POWER AMPLIFIER
* 5u 10u
* LOW NOISE AMPLIFIER
* 5u 10u
* 5u 10u
* I MIXER
* Q MIXER
.lib UniversalOpAmp2.lib
.backanno
.end